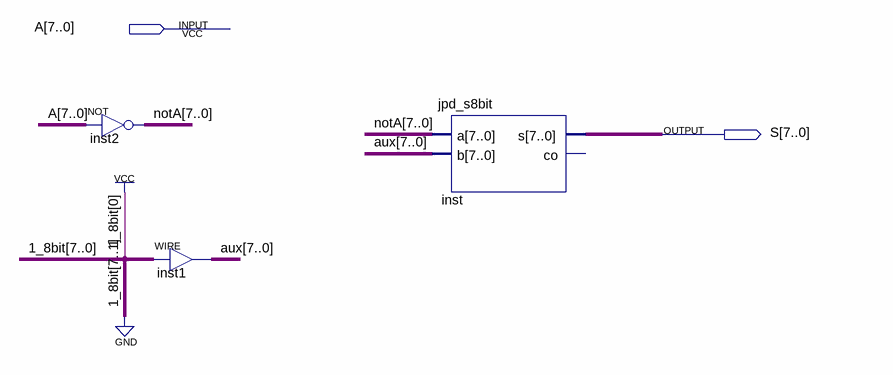
[diagram p0: schematic sheet]
// Quartus schematic jpd_neg_8bit.bdf as structural Verilog: 3 symbols, 2 pins
module jpd_neg_8bit (
  input  [7:0] A,
  output [7:0] S
);

  wire [7:0] aux, notA;

  assign notA = ~A;  // NOT inst2, 8 bits wide
  assign aux = 8'b00000001;  // WIRE inst1
  jpd_s8bit inst (.a(notA), .b(aux), .s(S));  // open: co
endmodule
